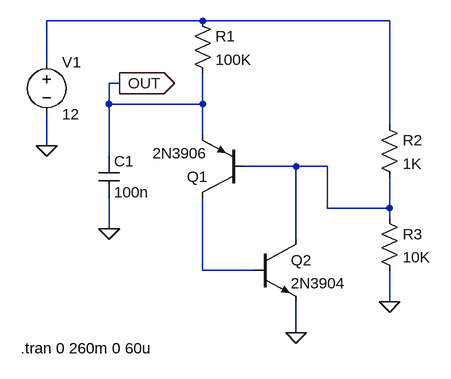
[diagram p0: schematic Design and Simulation of UJT Relaxation Oscillator using LT Spice simulator.asc]
Design and Simulation of UJT Relaxation Oscillator using LT Spice simulator.asc, the LTspice schematic file:
Version 4.1
SHEET 1 880 680
WIRE 352 48 112 48
WIRE 640 48 352 48
WIRE 112 112 112 48
WIRE 224 144 208 144
WIRE 208 176 208 144
WIRE 352 176 352 128
WIRE 352 176 208 176
WIRE 640 208 640 48
WIRE 352 224 352 176
WIRE 112 240 112 192
WIRE 208 256 208 176
WIRE 496 272 416 272
WIRE 544 272 496 272
WIRE 544 336 544 272
WIRE 640 336 640 288
WIRE 640 336 544 336
WIRE 640 352 640 336
WIRE 208 368 208 320
WIRE 496 384 496 272
WIRE 352 432 352 320
WIRE 432 432 352 432
WIRE 640 480 640 432
WIRE 496 528 496 480
FLAG 112 240 0
FLAG 496 528 0
FLAG 640 480 0
FLAG 208 368 0
FLAG 224 144 OUT
IOPIN 224 144 Out
SYMBOL voltage 112 96 R0
SYMATTR InstName V1
SYMATTR Value 12
SYMBOL res 336 32 R0
SYMATTR InstName R1
SYMATTR Value 100K
SYMBOL res 624 192 R0
SYMATTR InstName R2
SYMATTR Value 1K
SYMBOL res 624 336 R0
SYMATTR InstName R3
SYMATTR Value 10K
SYMBOL pnp 416 320 R180
SYMATTR InstName Q1
SYMATTR Value 2N3906
SYMBOL npn 432 384 R0
SYMATTR InstName Q2
SYMATTR Value 2N3904
SYMBOL cap 192 256 R0
SYMATTR InstName C1
SYMATTR Value 100n
TEXT 72 552 Left 2 !.tran 0 260m 0 60u

The netlist it stands for:
* Design and Simulation of UJT Relaxation Oscillator using LT Spice simulator.asc
V1 N001 0 12
R1 N001 OUT 100K
R2 N001 N002 1K
R3 N002 0 10K
Q1 N003 N002 OUT 0 2N3906
Q2 N002 N003 0 0 2N3904
C1 OUT 0 100n
.model NPN NPN
.model PNP PNP
.lib standard.bjt
.tran 0 260m 0 60u
.backanno
.end